# Altium schematic sheet ArduinoPWR-COMM-DIG_SDCard.SchDoc
size A
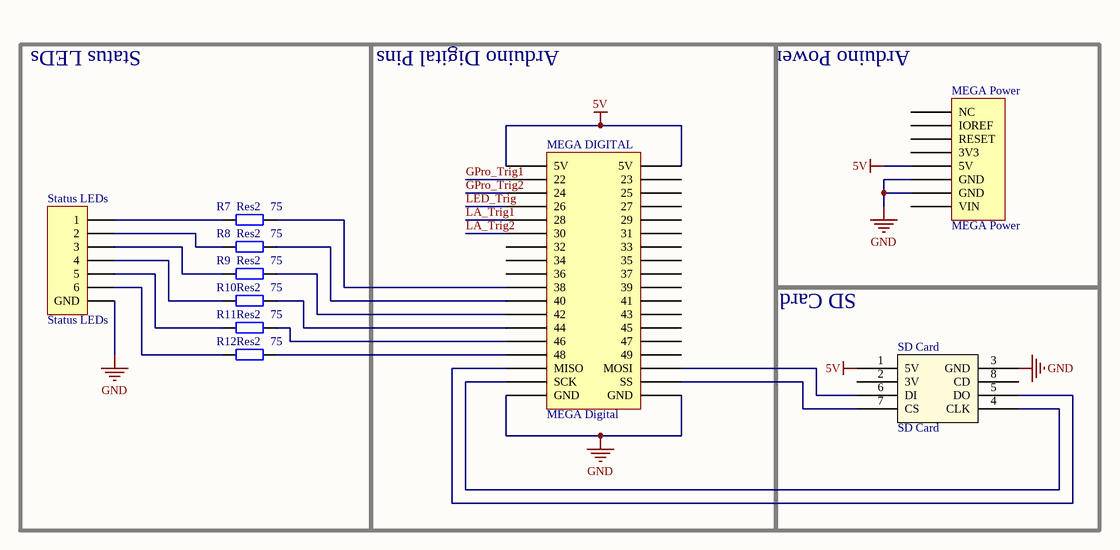
[diagram p0: ArduinoPWR-COMM-DIG_SDCard.SchDoc]

## Parts
MEGA_DIGITAL  MEGA Digital  [HDR2X18]
MEGA_Power  MEGA Power  [HDR1X8]
R7  Res2  value 75  [AXIAL-0.4]
R8  Res2  value 75  [AXIAL-0.4]
R9  Res2  value 75  [AXIAL-0.4]
R10  Res2  value 75  [AXIAL-0.4]
R11  Res2  value 75  [AXIAL-0.4]
R12  Res2  value 75  [AXIAL-0.4]
SD_Card  SD Card  [HDR1X8]
Status_LEDs  Status LEDs  [HDR1X7]

## Blocks framed on the sheet
Status LEDs: R7-R12 Status_LEDs
Arduino Digital Pins: MEGA_DIGITAL
SD Card: SD_Card

## Nets
5V: MEGA_DIGITAL.1(5V) MEGA_DIGITAL.2(5V) MEGA_Power.5(5V) SD_Card.1(5V)
GND: MEGA_DIGITAL.35(GND) MEGA_DIGITAL.36(GND) MEGA_Power.6(GND) MEGA_Power.7(GND) SD_Card.3(GND) Status_LEDs.7(GND)
GPro_Trig1: MEGA_DIGITAL.5(22)
GPro_Trig2: MEGA_DIGITAL.25(24)
LA_Trig1: MEGA_DIGITAL.9(28)
LA_Trig2: MEGA_DIGITAL.11(30)
LED_Trig: MEGA_DIGITAL.7(26)
NetMEGA_DIGITAL_3: MEGA_DIGITAL.3(44) R10.1
NetMEGA_DIGITAL_19: MEGA_DIGITAL.19(38) R7.1
NetMEGA_DIGITAL_21: MEGA_DIGITAL.21(40) R8.1
NetMEGA_DIGITAL_23: MEGA_DIGITAL.23(42) R9.1
NetMEGA_DIGITAL_27: MEGA_DIGITAL.27(46) R11.1
NetMEGA_DIGITAL_29: MEGA_DIGITAL.29(48) R12.1
NetMEGA_DIGITAL_31: MEGA_DIGITAL.31(MISO) SD_Card.5(DO)
NetMEGA_DIGITAL_32: MEGA_DIGITAL.32(MOSI) SD_Card.6(DI)
NetMEGA_DIGITAL_33: MEGA_DIGITAL.33(SCK) SD_Card.4(CLK)
NetMEGA_DIGITAL_34: MEGA_DIGITAL.34(SS) SD_Card.7(CS)
NetR7_2: R7.2 Status_LEDs.1
NetR8_2: R8.2 Status_LEDs.2
NetR9_2: R9.2 Status_LEDs.3
NetR10_2: R10.2 Status_LEDs.4
NetR11_2: R11.2 Status_LEDs.5
NetR12_2: R12.2 Status_LEDs.6

Not connected (* = marked no-connect by the designer): MEGA_DIGITAL 4(23) 6(25) 8(27) 10(29) 12(31) 13(32) 14(33) 15(34) 16(35) 17(36) 18(37) 20(39) 22(41) 24(43) 26(45) 28(47) 30(49); MEGA_Power 1(NC) 2(IOREF) 3(RESET) 4(3V3) 8(VIN); SD_Card 2(3V) 8(CD)

## Notes on the sheet
- Arduino Power
- Title
- Size:
- Date:
- A
- Number:
- Time:
- Revision:
- Sheet
- of
- File:

## Library data of the parts
MEGA_DIGITAL MEGA_Power SD_Card = Component_1
R7-R12 = Res2: Resistor; Published: 8-Jun-2000; LatestRevisionDate: 17-Jul-2002; LatestRevisionNote: Re-released for DXP Platform.; PackageReference: AXIAL-0.4; Publisher: Altium Limited; PackageDescription: Axial Device, Thru-Hole; 2 Leads; 0.4 in Pin Spacing
Status_LEDs = Header 7: Header, 7-Pin; LatestRevisionDate: 17-Jul-2002; LatestRevisionNote: Re-released for DXP Platform.; Publisher: Altium Limited